# Altium schematic sheet Converter.SchDoc
size A3; SheetNumber: 1; SheetTotal: 1
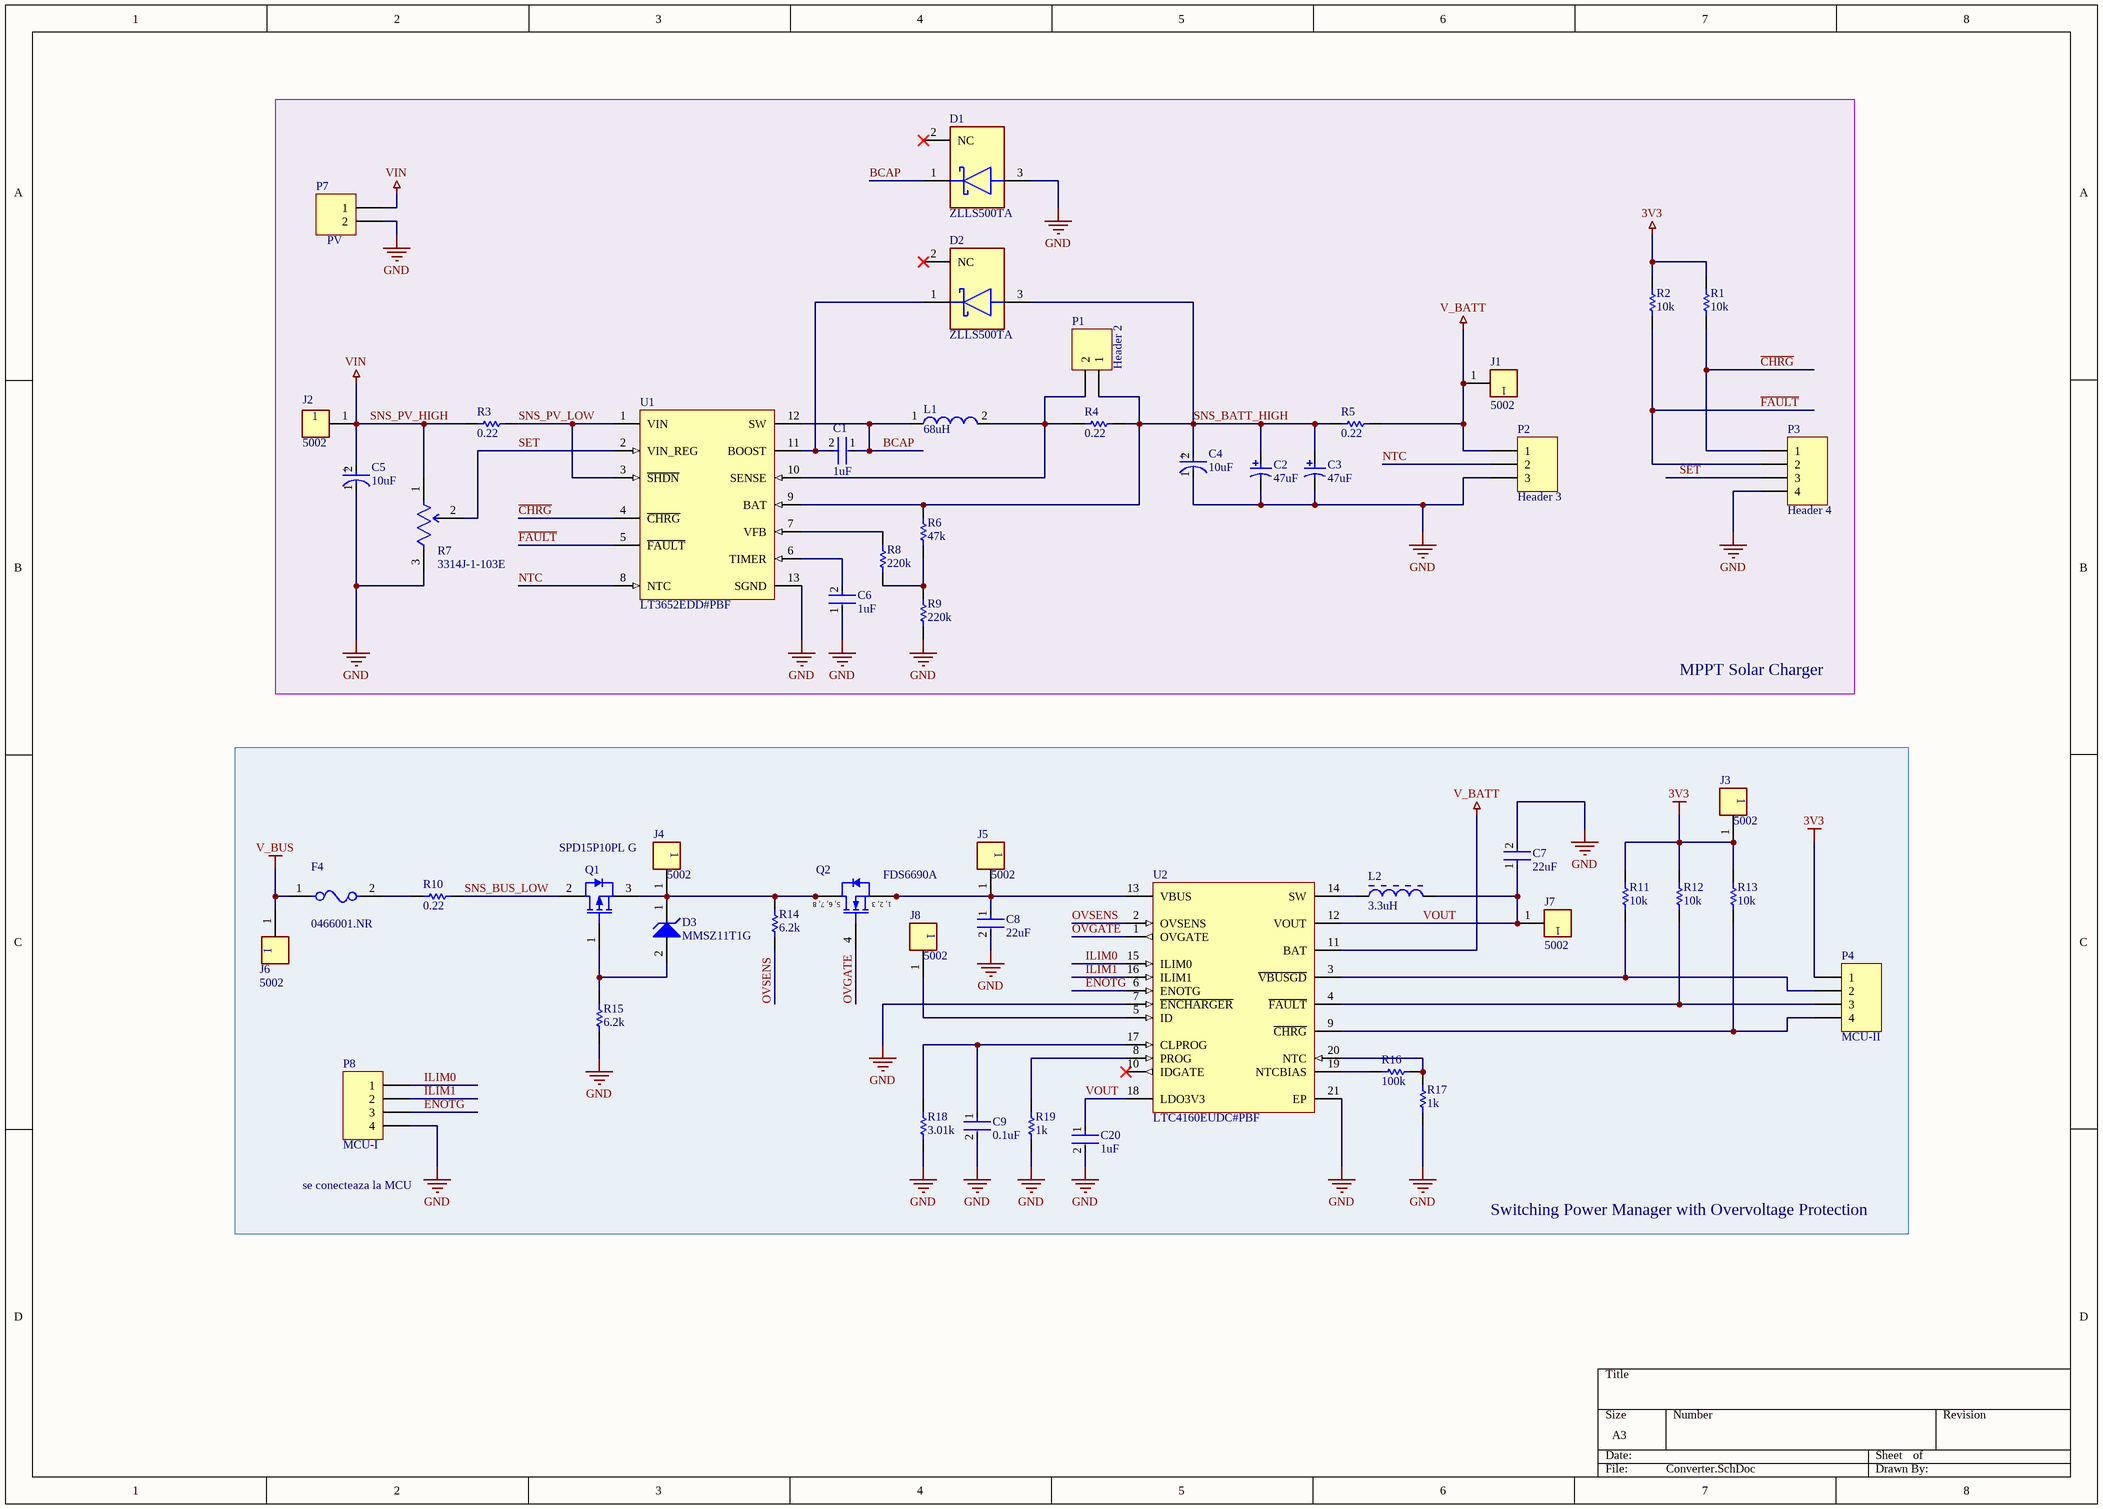
[diagram p0: Converter.SchDoc]

## Parts
C1  1uF  [FP-C1608-080-0_1-IPC_B]
C2  47uF  [KEMT-T491-D_L]
C3  47uF  [KEMT-T491-D_L]
C4  10uF  [FP-T491C106K016AT-MFG]
C5  10uF  [FP-T491D-MFG]
C6  1uF  [FP-C1608-080-0_1-IPC_B]
C7  22uF  [FP-C2012-125-0_2-IPC_C]
C8  22uF  [FP-C2012-125-0_2-IPC_C]
C9  0.1uF  [FP-GRM155-0_05-MFG]
C20  1uF  [FP-0603-L_1_6_0_15-W_0_81-IPC_A]
D1  ZLLS500TA  [FP-SOT23-IPC_B]
D2  ZLLS500TA  [FP-SOT23-IPC_B]
D3  MMSZ11T1G  [ONSC-SOD-123-2-425-04_V]
F4  0466001.NR  [FP-0466-MFG]
J1  5002  [FP-5002-MFG]
J2  5002  [FP-5002-MFG]
J3  5002  [FP-5002-MFG]
J4  5002  [FP-5002-MFG]
J5  5002  [FP-5002-MFG]
J6  5002  [FP-5002-MFG]
J7  5002  [FP-5002-MFG]
J8  5002  [FP-5002-MFG]
L1  68uH  [WE-PD2-XL]
L2  3.3uH  [BOUR-SRN3015-2_V]
P1  Header 2  [HDR1X2]
P2  Header 3  [HDR1X3]
P3  Header 4  [HDR1X4]
P4  MCU-II  [HDR1X4]
P7  PV  [HDR1X2]
P8  MCU-I  [HDR1X4]
Q1  SPD15P10PL G  [INF-PG-TO252-3-1_N]
Q2  FDS6690A  [FAIR-SOIC-8_V]
R1  10k  [RESC1609X55X30LL15T15]
R2  10k  [RESC1609X55X30LL15T15]
R3  0.22  [RESC3216X70X50LL05T20]
R4  0.22  [RESC3216X70X50LL05T20]
R5  0.22  [RESC3216X70X50LL05T20]
R6  47k  [RESC1608X55X30NL15T15]
R7  3314J-1-103E  [FP-3314J-1-MFG]
R8  220k  [RESC1608X55X25ML10T15]
R9  220k  [RESC1608X55X25ML10T15]
R10  0.22  [RESC3216X70X50LL05T20]
R11  10k  [RESC1609X55X30LL15T15]
R12  10k  [RESC1609X55X30LL15T15]
R13  10k  [RESC1609X55X30LL15T15]
R14  6.2k  [RESC1609X50X30ML10T20]
R15  6.2k  [RESC1609X50X30ML10T20]
R16  100k  [RESC1608X55X30ML15T15]
R17  1k  [RESC1608X55X30LL15T15]
R18  3.01k  [RESC1608X55X30LL15T15]
R19  1k  [RESC1608X55X30LL15T15]
U1  LT3652EDD#PBF  [LT-DD-12_V]
U2  LTC4160EUDC#PBF  [LT-UDC-20_N]

## Blocks framed on the sheet
MPPT Solar Charger: C1-C6 D1 D2 J1 J2 L1 P1-P3 P7 R1-R9 U1
Switching Power Manager with Overvoltage Protection: C7-C9 C20 D3 F4 J3-J8 L2 P4 P8 Q1 Q2 R10-R19 U2

## Nets
3V3: J3.1 P4.1 R1.1 R2.1 R11.2 R12.2 R13.2
GND: C2.2 C3.2 C4.1(C) C5.1(C) C6.1 C7.2 C8.2 C9.2 C20.2 D1.3(A) P2.3 P3.4 P7.2 P8.4 R7.3(CW) R9.1 R15.1 R17.1 R18.1 R19.1 U1.13(SGND) U2.7(~{ENCHARGER}) U2.21(EP)
SNS_PV_HIGH: C5.2(A) J2.1 P7.1 R3.1 R7.1(CCW)  [also labelled VIN]
V_BATT: J1.1 P2.1 R5.2 U2.11(BAT)
V_BUS: F4.1 J6.1
BCAP: C1.1 D1.1(C) L1.1 U1.12(SW)
~{CHRG}: P3.1 R1.2 U1.4(~{CHRG})
ENOTG: P8.3 U2.6(ENOTG)
~{FAULT}: P3.2 R2.2 U1.5(~{FAULT})
ILIM0: P8.1 U2.15(ILIM0)
ILIM1: P8.2 U2.16(ILIM1)
NTC: P2.2 U1.8(NTC)
OVGATE: Q2.4(G) U2.1(OVGATE)
OVSENS: R14.1 U2.2(OVSENS)
SET: P3.3 R7.2(WIPER) U1.2(VIN_REG)
SNS_BATT_HIGH: C2.1 C3.1 C4.2(A) D2.3(A) P1.1 R4.2 R5.1 R6.2 U1.9(BAT)
SNS_BUS_LOW: Q1.2(DRAIN) R10.2
SNS_PV_LOW: R3.2 U1.1(VIN) U1.3(~{SHDN})
VOUT: C7.1 C20.1 J7.1 L2.2 U2.12(VOUT) U2.18(LDO3V3)
NetC1_2: C1.2 D2.1(C) U1.11(BOOST)
NetC6_2: C6.2 U1.6(TIMER)
NetC8_1: C8.1 J5.1 Q2.1(S) Q2.2(S) Q2.3(S) U2.13(VBUS)
NetC9_1: C9.1 R18.2 U2.17(CLPROG)
NetD3_1: D3.1(K) J4.1 Q1.3(SOURCE) Q2.5(D) Q2.6(D) Q2.7(D) Q2.8(D) R14.2
NetD3_2: D3.2(A) Q1.1(GATE) R15.2
NetF4_2: F4.2 R10.1
NetJ8_1: J8.1 U2.5(ID)
NetL1_2: L1.2 P1.2 R4.1 U1.10(SENSE)
NetL2_1: L2.1 U2.14(SW)
NetP4_2: P4.2 R11.1 U2.3(~{VBUSGD})
NetP4_3: P4.3 R12.1 U2.4(~{FAULT})
NetP4_4: P4.4 R13.1 U2.9(~{CHRG})
NetR6_1: R6.1 R8.1 R9.2
NetR8_2: R8.2 U1.7(VFB)
NetR16_1: R16.1 U2.19(NTCBIAS)
NetR16_2: R16.2 R17.2 U2.20(NTC)
NetR19_2: R19.2 U2.8(PROG)

Not connected (* = marked no-connect by the designer): D1 2(NC)*; D2 2(NC)*; U2 10(IDGATE)*

## Notes on the sheet
- se conecteaza la MCU
- (in symbol CMP-2000-06260-1) 5, 6, 7, 8; 1, 2, 3
- (in symbol CMP-2000-07197-3) +
- (in symbol CMP-2000-07200-2) +

## Library data of the parts
C1 C6 = CMP-08246-002727-1: Multilayer Ceramic Capacitors 1μF ±10% 16V X7R SMD 0603; Mount: Surface Mount; Width: 0.031inch; Radiation Hardening: No; Dielectric Material: Ceramic; Packaging: Tape and Reel; Voltage Rating: 16V; Weight: 7.1E-05oz; Termination: SMD/SMT; Package Quantity: 1; Voltage Rating (DC): 16V; REACH SVHC: No SVHC; Voltage: 16V; Capacitance: 1uF; Min Operating Temperature: -55°C; Depth: 0.8mm; Height: 0.8mm; Length: 1.6mm; Case Code (Metric): 1608; Thickness: 0.037inch; Lead Free: Lead Free; Resistor Type: Ceramic; RoHS Compliant: Yes; Series: C; Construction: Flat; Max Operating Temperature: 125°C; Tolerance: 10%; Case/Package: 0603; Dielectric: X7R; Case Code (Imperial): 0603
C2 C3 = CMP-1664-00014-1: Tantalum Surface Mount Capacitor-Standard Tantalum, 47 uF, +/- 10%, 16 V, -55 to 125 degC, 2-Pin SMD, RoHS, Tape and Reel; Voltage Rating: 16 V; ESR: 3 Ohm; Capacitance: 10 uF; ComponentLink2Description: Datasheet; Case/Package: 1206; Length: 3.2 mm; ComponentLink1Description: Manufacturer URL; Case Code (Metric): 3216; Packaging: Cut Tape; Width: 1.6 mm; RoHSCompliant: True; Min Operating Temperature: -55degC; Case Code (Imperial): 1206; Max Operating Temperature: 125degC; PackageReference: T491-D; Mount: Surface Mount; DatasheetVersion: Jun-16; ComponentLink1URL: http://www.kemet.com/; Height: 1.8 mm; Tolerance: 10%; Radiation Hardening: No; REACH SVHC: No SVHC; ComponentLink2URL: http://www.kemet.com/Lists/ProductCatalog/Attachments/254/KEM_T2005_T491.pdf; Package Quantity: 1; Pins: 2; PackageDescription: 2-Pin Surface Mount Device, Body 7.3 x 4.3 mm
C4 = CMP-2000-07197-3: CAP TANT 10UF 10% 16V 2312; Dielectric Material: Tantalum; Polarity: Polar; Dissipation Factor: 6%; Leakage Current: 1.6uA; Ripple Current: 247mA; Life (Hours): 2000Hour; ESR (Equivalent Series Resistance): 1.8R; Height: 2.5mm; Length: 6mm; Min Operating Temperature: -55°C; Case/Package: Molded; Voltage: 16V; Height - Seated (Max): 0.11inch; Package Quantity: 1; RoHS Compliant: Yes; Termination: SMD/SMT; REACH SVHC: No SVHC; Case Code (Imperial): 2312; Tolerance: 10%; Capacitance: 10uF; Voltage Rating (DC): 16V; Mount: Surface Mount; Radiation Hardening: No; Case Code (Metric): 6032; Packaging: Tape and Reel; Depth: 3.2mm; Width: 3.2mm; Max Operating Temperature: 125°C; Features: General Purpose; Voltage Rating: 16V; Lead Free: Lead Free
C5 = CMP-2000-07200-2: CAP TANT 10UF 10% 25V 2917; Tolerance: 20%; Life (Hours): 2000Hour; Dielectric Material: Tantalum; Dissipation Factor: 6%; Leakage Current: 2.5uA; Ripple Current: 387mA; Polarity: Polar; ESR (Equivalent Series Resistance): 1R; Voltage: 25V; Capacitance: 10uF; Voltage Rating: 25V; Voltage Rating (DC): 25V; Depth: 4.3mm; Mount: Surface Mount; Length: 7.3mm; Termination: SMD/SMT; Radiation Hardening: No; Max Operating Temperature: 125°C; REACH SVHC: No SVHC; Height: 2.8mm; Package Quantity: 1; Packaging: Tape and Reel; Case Code (Imperial): 2917; Width: 4.3mm; Min Operating Temperature: -55°C; Features: General Purpose; Case Code (Metric): 7343; Height - Seated (Max): 0.122inch; Number of Pins: 2; Lead Free: Lead Free; Case/Package: 2917
C7 C8 = CMP-2000-06037-3: Multilayer Ceramic Capacitors 22μF ±10% 16V X5R SMD 0805; Thickness: 0.057inch; Series: C; Weight: 0.000194oz; Construction: Flat; Max Operating Temperature: 85°C; Case Code (Imperial): 0805; Width: 0.049inch; Depth: 1.25mm; Dielectric: X5R; Capacitance: 22uF; Case/Package: 0805; Voltage Rating: 16V; Mount: Surface Mount; Dielectric Material: Ceramic; Packaging: Tape and Reel; Resistor Type: Ceramic; Number of Pins: 2; Lead Free: Lead Free; REACH SVHC: No SVHC; Tolerance: 10%; Termination: Wraparound; Min Operating Temperature: -55°C; Case Code (Metric): 2012; RoHS Compliant: Yes; Voltage: 16V; Length: 2mm; Voltage Rating (DC): 16V; Package Quantity: 1; Height: 1.25mm
C9 = CMP-2008-04599-2: CAP CER 0.1UF 16V X7R 0402; Tolerance: 5%; Capacitance: 100nF; Height: 0.5mm; Min Operating Temperature: -55°C; Voltage Rating: 16V; Termination: Standard; Dielectric: X7R; Max Operating Temperature: 125°C; Package Quantity: 10000; Case/Package: 0402; Case Code (Metric): 1005; Depth: 0.5mm; Voltage: 16V; Width: 0.5mm; RoHS Compliant: Yes; Length: 1mm; Case Code (Imperial): 0402; Thickness: 0.022inch; Mount: Surface Mount; REACH SVHC: No SVHC; Weight: 0.000212oz; Voltage Rating (DC): 16V; Series: GRM; Packaging: Cut Tape; Radiation Hardening: No; Lead Free: Lead Free
C20 = CMP-2006-04559-3: General Purpose Ceramic Capacitor, 0603, 1uF, 10%, X5R, 15%, 10V; Insulation Resistance: 100GR; Dissipation Factor: 5%; Packaging: Tape and Reel; RoHS Compliant: Yes; Height: 0.9mm; Tolerance: 10%; Length: 1.6mm; Depth: 0.81mm; Case/Package: 0603; Max Operating Temperature: 85°C; Series: -; Dielectric: X5R; Construction: Flat; Capacitance: 1uF; REACH SVHC: No SVHC; Voltage Rating: 10V; Number of Pins: 2; Radiation Hardening: No; Case Code (Imperial): 0603; Min Operating Temperature: -55°C; Termination: SMD/SMT; Contact Plating: Tin; Voltage: 10V; Thickness: 0.035inch; Lead Free: Lead Free; Mount: Surface Mount; Width: 0.81mm; Voltage Rating (DC): 10V; Package Quantity: 4000; Case Code (Metric): 1608
D1 D2 = CMP-12790-000060-1: DIODE SCHOTTKY 40V 700MA SOT23-3; Max Forward Surge Current (Ifsm): 3.2A; Polarity: Standard; Peak Reverse Current: 10uA; Forward Voltage: 800mV; Peak Non-Repetitive Surge Current: 13A; Capacitance: 16pF; Power Dissipation: 500mW; Element Configuration: Single; Reverse Recovery Time: 3ns; Max Reverse Voltage (DC): 40V; Min Operating Temperature: -55°C; Height: 1mm; Termination: SMD/SMT; Forward Current: 700mA; Current Rating: 700mA; Max Operating Temperature: 150°C; Case/Package: SOT-23; Output Current: 700mA; Lead Free: Lead Free; Radiation Hardening: No; Mount: Surface Mount; Weight: 0.000282oz; Package Quantity: 3000; Width: 1.4mm; Packaging: Tape and Reel; Length: 3.05mm; Average Rectified Current: 700mA; Number of Pins: 3; Max Repetitive Reverse Voltage (Vrrm): 40V; Voltage Rating (DC): 40V
D3 = CMP-1060-00402-1: Zener Voltage Regulator, 500 mW, 2-Pin SOD-123, Pb-Free, Tape and Reel; Manufacturer: On Semiconductor; P Max (W): 0.5; ComponentLink2URL: http://www.onsemi.com/pub_link/Collateral/MMSZ2V4T1-D.PDF; DatasheetVersion: Rev. 11; ComponentLink1Description: Manufacturer URL; ComponentLink3URL: http://www.onsemi.com/pub_link/Collateral/425-04.PDF; ComponentLink1URL: http://www.onsemi.com/; PackageDescription: 2-Pin SOD, Body 1.6 x 2.69 mm; PackageVersion: Rev. G, 10/2009; ComponentLink3Description: Package Specification; ComponentLink2Description: Datasheet; Mounting Technology: Surface Mount; PartNumber: MMSZ11T1G; RoHS: Pb-Free; Packing: Tape and Reel; PackageReference: SOD-123-2-425-04
F4 = CMP-08605-000058-1: FUSE BOARD MNT 1A 63VAC/VDC 1206; Manufacturer: Littelfuse Inc; Max Fuse Dc Voltage: 63V; Fuse Interrupt Ac Current: 50A; Fuse Voltage Drop: 79.97mV; Resistance: 0.075Ω; Value: 0.075Ω; Fuse I2T: 0.0423A2Sec; Fuse Blow Speed: Fast; Temperature Range High: +90°C; Max Fuse Ac Voltage: 63V; Manufacturer Part Number: 0466001.NR; Package: 0466; ComponentLink2URL: https://www.littelfuse.com/~/media/electronics/datasheets/fuses/littelfuse_fuse_466_datasheet.pdf.pdf; Device Class L3: unset; Lead Free: Yes; Automotive: No; Digikey Description: FUSE BOARD MNT 1A 63VAC/VDC 1206; Height: 0.66mm; Temperature Range Low: -55°C; Category: Fuse; ComponentLink2Description: Datasheet; Device Class L1: Circuit Protection; Device Class L2: Fuses; Fuse Current: 1A; Mouser Description: Surface Mount Fuses 63V FA 1206 1A VFA Slimline; Octopart: https://octopart.com/0466001.nr-littelfuse-566005; Fuse Interrupt Dc Current: 50A; RoHS: TRUE; Voltage Rating: 63V; Temperature: -55°C to +90°C
J1-J8 = CMP-2000-05182-2: PC TEST POINT MINIATURE WHITE; Body Material: Bronze; Insulation: Insulated; Inside Diameter: 1.27mm; Number of Ports: 1; Outside Diameter: 2.54mm; Hole Diameter: 1.6mm; Plating: Silver; Contact Plating: Silver; Orientation: Straight; REACH SVHC: No SVHC; Series: THM; Packaging: Bulk; Material: Nylon; Flammability Rating: UL94 V-0; Mount: Through Hole; Color: White; Housing Color: White; Length: 7.62mm; Contact Material: Bronze; Lead Free: Lead Free; Package Quantity: 100; RoHS Compliant: Yes
L1 = CMP-0227-00489-1: SMD Power Inductor WE-PD2, L = 68.0 µH; Inductance: 68.0 ÂµH; ComponentLink1URL: http://www.we-online.com; ComponentLink2Description: Datasheet; ComponentLink2URL: http://www.we-online.de/katalog/media/pdf/744776168.pdf; PackageVersion: 2004; DatasheetVersion: ver 1, Oct-2004; ComponentLink1Description: Manufacturer Link; PackageDescription: SMD Inductor, 2-Leads, Body 10.0 x 9.0 mm; PackageReference: WE-PD2-XL
L2 = CMP-0007-00001-1: Semi-shielded Power Inductor, 3.3 uH, +/- 20%, 1.6 A, -40 to 125 degC, 3 x 3 x 1.5 mm SMD, RoHS and Halogen Free, Tape and Reel; Manufacturer: Bourns; PartNumber: SRN3015-3R3M; DCR Max: 0.112 Ohm; Resistance to Solder Heat: +260 degC for 10 sec.; Rated current: 1.6 A; SRF Min: 75 MHz; Isat: 1.4 A; Inductance tolerance: +/- 20%; PackageDescription: 2-Pin SMD, Body 3 x 3 mm, Height 1.5 mm; ComponentLink1URL: http://www.bourns.com/; ComponentLink3URL: http://www.bourns.com/data/global/pdfs/SRN3015.pdf; RoHS: TRUE; ComponentLink2URL: http://www.bourns.com/data/global/pdfs/SRN3015.pdf; Inductance: 3.3 uH; DatasheetVersion: Aug-11; ComponentLink3Description: Package Specification; ComponentLink2Description: Datasheet; Packing: Tape and Reel; ComponentLink1Description: Manufacturer URL; Mounting Technology: Surface Mount; PackageReference: SRN3015; Operating Temperature: -40 to 125 degC
P1 P7 = Header 2: Header, 2-Pin; LatestRevisionDate: 17-Jul-2002; LatestRevisionNote: Re-released for DXP Platform.; Publisher: Altium Limited
P2 = Header 3: Header, 3-Pin; LatestRevisionDate: 17-Jul-2002; LatestRevisionNote: Re-released for DXP Platform.; Publisher: Altium Limited
P3 P4 P8 = Header 4: Header, 4-Pin; LatestRevisionDate: 17-Jul-2002; LatestRevisionNote: Re-released for DXP Platform.; Publisher: Altium Limited
Q1 = CMP-1099-00052-1: P-Channel SIPMOS Power-Transistor, -100 V VDS, -15 A ID, -55 to 175 degC, PG-TO252-3-1, Reel, Green; Manufacturer: Infineon; Pto t (max): 128Â W; RDS (on) (max): 200Â mOhm; ID (max): -15Â A; VDS (max): -100Â V; RDS (on) (max) (@4.5V): 270Â mOhm; IDpuls (max): -60Â A; VGS(th) (max): -2Â V; QG: 47Â nC; Mode: Enhancement; Rth: 1.17Â K/W; VGS(th) (min): -1Â V; Polarity: P; Green: TRUE; PackageReference: PG-TO252-3-1; Mounting Technology: Surface Mount; ComponentLink1Description: Manufacturer URL; ComponentLink3Description: Package Specification; DatasheetVersion: Rev. 1.5; ComponentLink2Description: Datasheet; PackageDescription: 3-Pin Plastic (Green) Transistor Single Outline Package, 6.5 x 6.12 mm Body, 2.28 mm Pitch; Technology: SIPMOS; ComponentLink2URL: http://www.infineon.com/dgdl/SPD15P10PL%2BG_Rev1.5.pdf?folderId=db3a304314dca38901154a72e3951a65&fileId=db3a30433c1a8752013c39ff5f2e4af3; ComponentLink3URL: http://www.infineon.com/dgdl/TLE42744_DS_11.pdf?folderId=db3a304318f3fe290118f5a433570040&fileId=db3a304327b897500128012ccafe37d2&sId=db3a30443d67b5ca013d83f7c0ea327b; Packing: Reel; ComponentLink1URL: http://www.infineon.com/; PackageVersion: Jan-10; PartNumber: SPD15P10PL G
Q2 = CMP-2000-06260-1: Single N-Channel, Logic-Level, PowerTrench(R) MOSFET, 11 A, 30 V, -55 to 150 degC, 8-Pin SOIC (SO-8), RoHS, Tape and Reel; Manufacturer: Fairchild Semiconductor; Typical Turn-Off Delay Time: 28ns; Transistor Material: Si; Typical Turn-On Delay Time: 9ns; Channel Mode: Enhancement; Maximum Power Dissipation: 2.5W; Typical Input Capacitance @ Vds: 1205pF@15V; Maximum Continuous Drain Current: 11A; Maximum Gate Source Voltage: ±20V; Channel Type: N; Typical Gate Charge @ Vgs: 12nC@5V; Number of Elements per Chip: 1; Minimum Gate Threshold Voltage: 1V; Maximum Drain Source Resistance: 0.013Ω; Maximum Drain Source Voltage: 30V; Datasheet Version: Rev. E1, 02/2007; Length: 5mm; Category: PowerMOSFET; Mounting Type: SurfaceMount; Pin Count: 8; Minimum Operating Temperature: -55°C; Dimensions: 5x4x1.5mm; Package Type: SOIC; Width: 4mm; Datasheet URL: https://www.fairchildsemi.com/datasheets/FD/FDS6690A.pdf; Manufacturer URL: https://www.fairchildsemi.com/; Package URL: https://www.fairchildsemi.com/package-drawings/M0/M08A.pdf; Mounting Technology: SurfaceMount; Package Reference: SOIC-8; Maximum Operating Temperature: +150°C; Package Description: 8-Pin Small Outline Integrated Circuit, Body 4.9 x 3.9 mm, Pitch 1.27 mm; Transistor Configuration: Single; Height: 1.5mm
R1 R2 R11-R13 = CMP-1012-00623-3: Chip Resistor, 10 KOhm, +/- 1%, 0.1 W, -55 to 155 degC, 0603 (1608 Metric), RoHS, Tape and Reel; Manufacturer: Panasonic; Voltage Rating: 75V; Case\/Package: 0603; Power Rating: 100mW; Resistance: 10KOhm; Temperature Coefficient: 100ppm\/degreesC; Number of Pins: 2; Package Reference: 603; Depth: 0.8mm; Mount: SurfaceMount; Package Description: 2-Pin Surface Mount Device, Body 1.6 x 0.85 mm; Datasheet Version: 02/2017; Length: 1.6mm; Lead Free: LeadFree; Height: 0.45mm; Number of Terminations: 2; Max Power Dissipation: 100mW; Min Operating Temperature: -55degC; Datasheet URL: https://industrial.panasonic.com/cdbs/www-data/pdf/RDA0000/AOA0000C304.pdf; Termination: SMD/SMT; Case Code (Metric): 1608; Case Code (Imperial): 0603; Tolerance: 1%; Max Operating Temperature: 155degC; RoHSCompliant: true; Voltage Rating (DC): 75V; Radiation Hardening: No; Packaging: TapeandReel; Composition: ThickFilm; Mounting Technology: SurfaceMount; Manufacturer URL: http://www.panasonic.com/; Width: 0.031inch; REACH SVHC: NoSVHC; Contact Plating: Tin; Military Standard: Not; Package Quantity: 1
R3-R5 R10 = CMP-2003-00694-1: Manufacturer: Panasonic; Part Number: ERJ-8RQFR22V
R6 = CMP-2000-00523-2: Chip Resistor, 47 KOhm, +/- 1%, 0.1 W, -55 to 155 degC, 0603 (1608 Metric), RoHS, Tape and Reel; Case\Package: 0603; Forward Current: 20 mA; Power Rating: 90 mW; Illumination Colour: Red; Nominal Vf: 2.1 V; Viewing Angle: 160 degrees; Luminous Intensity: 63 mcd; Lens Style: Clear; Nominal Wavelength: 639 nm; Case Code (Imperial): 0603; Case Code (Metric): 1608; Packaging: Tape and Reel; Radiation Hardening: No; Colour: Red; PackageDescription: 2-Pin Surface Mount Device, Body 1.6 x 0.85 mm; ComponentLink1Description: Manufacturer URL; Width: 0.8 mm; DatasheetVersion: Apr-15; ComponentLink2URL: http://industrial.panasonic.com/cdbs/www-data/pdf/RDA0000/AOA0000C86.pdf; Min Operating Temperature: -40 degC; Height: 0.6 mm; Package Quantity: 3000; ComponentLink2Description: Datasheet; REACH SVHC: No SVHC; ComponentLink1URL: http://www.panasonic.com/; Mount: Surface Mount; RoHSCompliant: true; Max Operating Temperature: 100 degC; PackageReference: 0603; Length: 1.6 mm; Forward Voltage: 2.1 V; Pins: 2
R7 = CMP-07234-000035-1: TRIMMER 10K OHM 0.25W J LEAD TOP; RoHS Compliant: Yes
R8 R9 = CMP-1659-00037-1: Chip Resistor, 220 KOhm, +/- 1%, 100 mW, -55 to 155 degC, 0603 (1608 Metric), RoHS, Tape and Reel; Resistance: 0.1 Ohm; ComponentLink1Description: Manufacturer URL; ComponentLink2Description: Datasheet; ComponentLink1URL: http://www.yageo.com/; REACH SVHC: No SVHC; RoHSCompliant: true; DatasheetVersion: Rev. 4, 02/2016; Min Operating Temperature: -25 degC; Height: 0.25 inch; ComponentLink2URL: http://www.yageo.com/documents/recent/PYu-RC_Group_51_RoHS_L_04.pdf; PackageDescription: 2-Pin Surface Mount Device, Body 1.6 x 0.8 mm; Max Operating Temperature: 70 degC; Width: 0.25 inch; Length: 0.75 inch; PackageReference: 0603
R14 R15 = CMP-2000-03545-1: Part Number: CRCW06036K20FKEA; Manufacturer: Vishay Dale
R16 = CMP-2000-00182-1: Part Number: ERJ-3EKF1003V; Manufacturer: Panasonic
R17 R19 = CMP-2000-00180-1: Part Number: ERJ-3EKF1001V; Manufacturer: Panasonic
R18 = CMP-2000-00416-1: Part Number: ERJ-3EKF3011V; Manufacturer: Panasonic
U1 = CMP-0473-00061-1: Power Tracking 2 A Battery Charger for Solar Power, 12-pin SON (DD-12), -40 to 125 degC, Pb-Free; Manufacturer: Linear Technology; Vin Max(V): 32; Vin Min(V): 4.95; Number of Outputs: 1; PartNumber: LT3652EDD#PBF; ComponentLink3Description: Package Specification; Mounting Technology: Surface Mount; ComponentLink1Description: Manufacturer URL; Topology: Battery Charger; ComponentLink2Description: Datasheet; PackageDescription: 12-Pin Plastic DFN, Body 3 x 3 mm, Pitch 0.45 mm; ComponentLink1URL: http://www.linear.com/; PackageVersion: Rev. A, 06/2010; PackageReference: DD-12; ComponentLink3URL: http://cds.linear.com/docs/en/packaging/DFN_12_05-08-1725.pdf; DatasheetVersion: Rev. D; Energy Source: Solar; ComponentLink2URL: http://cds.linear.com/docs/en/datasheet/3652fd.pdf; RoHS: TRUE
U2 = CMP-0478-00217-1: Switching Power Manager with USB On-The-Go And Overvoltage Protection, 4.35 to 5.5 V Vin, 20-pin QFN (UDC-20), -40 to 85 degC, Pb-Free; Manufacturer: Linear Technology; Number of Outputs: 1; Vin Min(V): 4.35; Vin Max(V): 5.5; ComponentLink2URL: http://cds.linear.com/docs/en/datasheet/41601fa.pdf; PackageDescription: 20-Pin Plastic QFN, Body 3 x 4 mm, Pitch 0.5 mm; PartNumber: LTC4160EUDC#PBF; DatasheetVersion: Rev. A; ComponentLink3URL: http://cds.linear.com/docs/en/packaging/QFN_20_05-08-1742.pdf; PackageReference: UDC20; RoHS: TRUE; Mounting Technology: Surface Mount; ComponentLink1URL: http://www.linear.com/; ComponentLink1Description: Manufacturer URL; PackageVersion: Rev. Ã˜, 06/2010; ComponentLink2Description: Datasheet; Number of Cells: 1; ComponentLink3Description: Package Specification